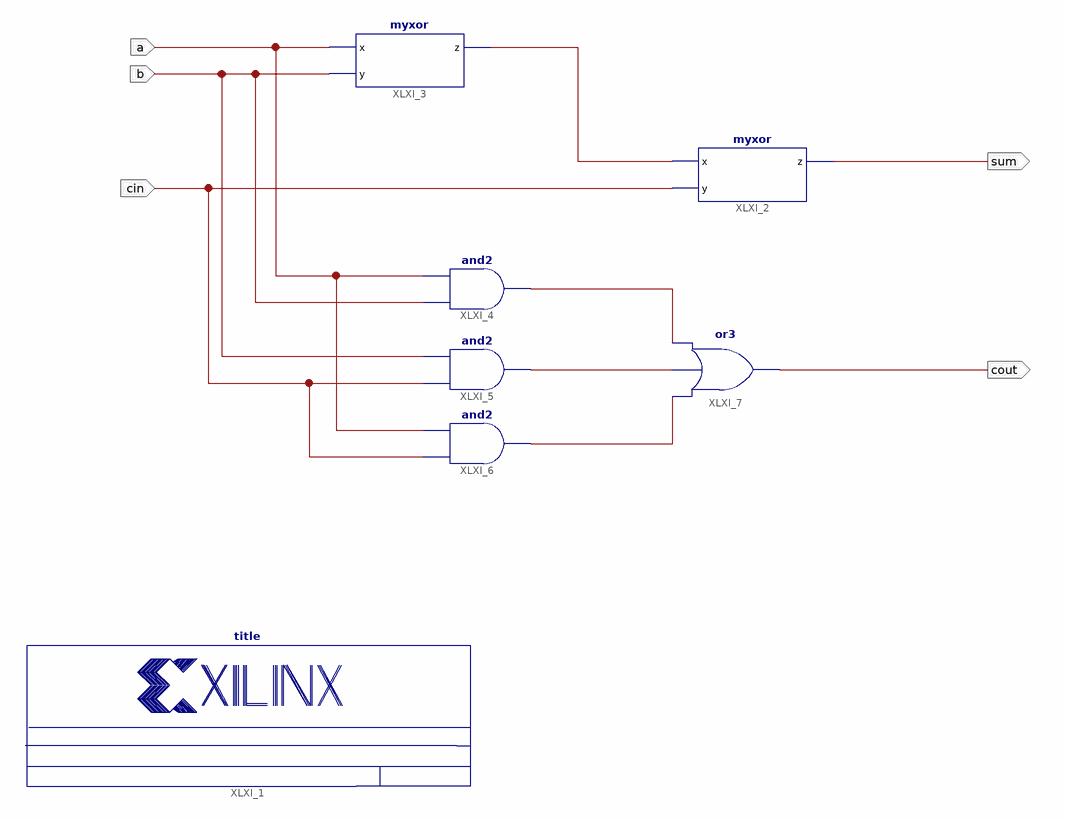
[diagram p0: schematic sheet 1]
// Xilinx ISE schematic fuller_adder_sch.sch (spartan3e) as structural Verilog: 7 symbols, 5 ports
module fuller_adder_sch (
  input  b,
  input  a,
  input  cin,
  output sum,
  output cout
);

  wire XLXN_5, XLXN_16, XLXN_17, XLXN_18;

  title #(.NameFieldText("Full adder")) XLXI_1 ();
  myxor XLXI_2 (.x(XLXN_5), .y(cin), .z(sum));
  myxor XLXI_3 (.x(a), .y(b), .z(XLXN_5));
  and XLXI_4 (XLXN_16, b, a);
  and XLXI_5 (XLXN_17, cin, b);
  and XLXI_6 (XLXN_18, cin, a);
  or XLXI_7 (cout, XLXN_18, XLXN_17, XLXN_16);
endmodule
